# EAGLE schematic dw08b (EAGLE 6.6.0)

## Sheet 1 of 6
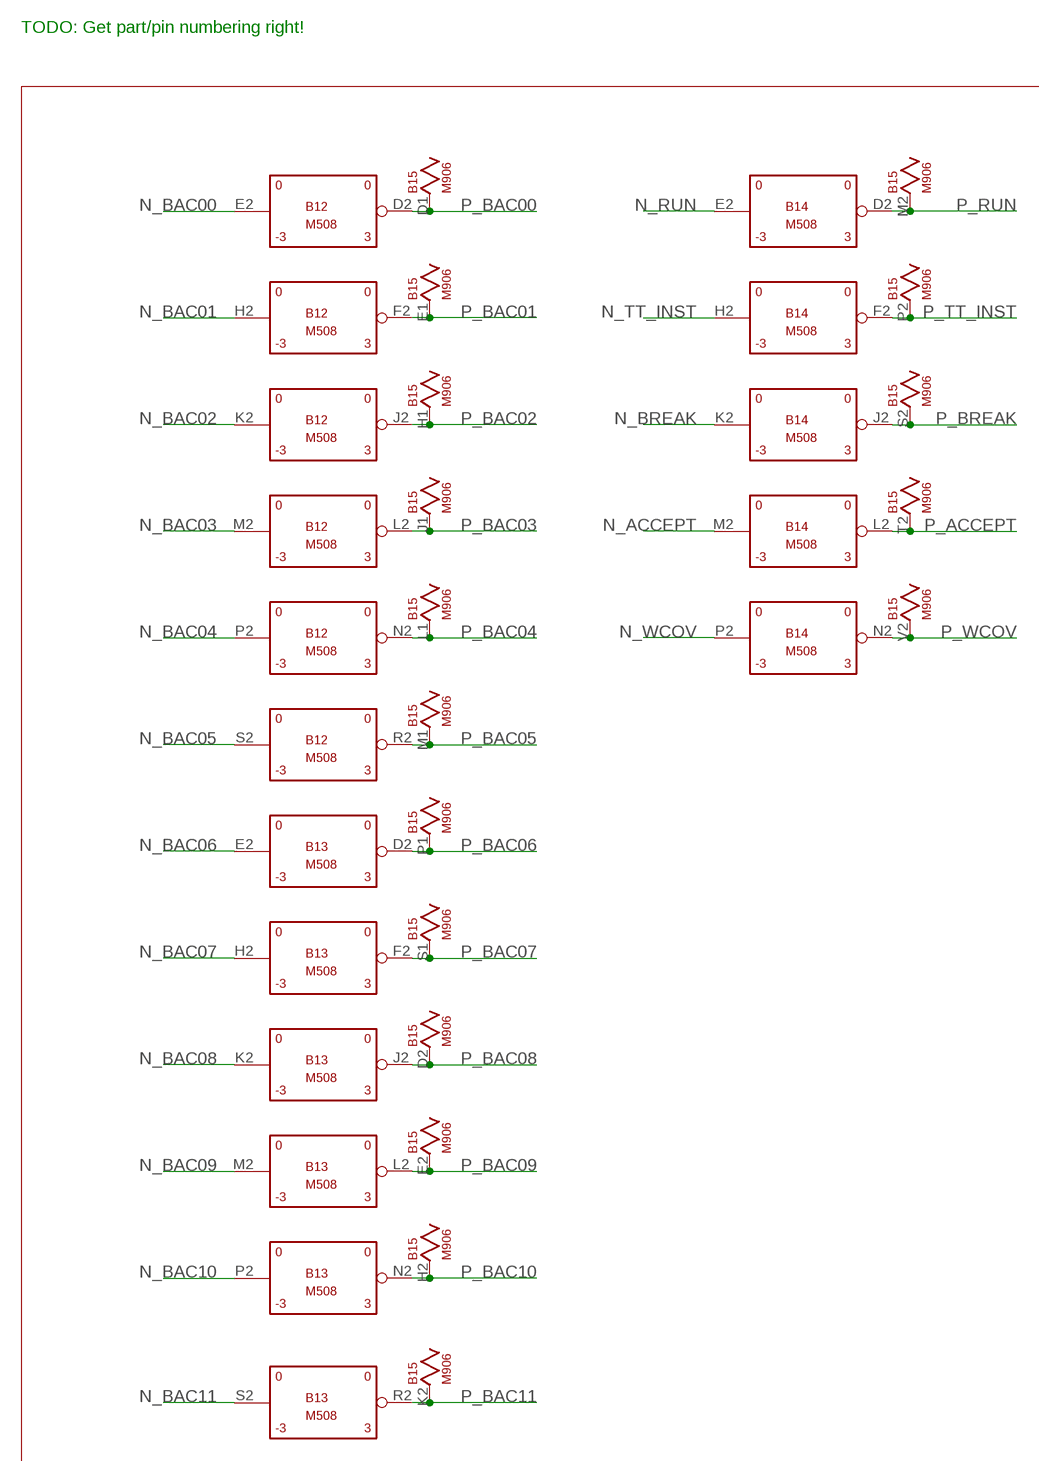
[diagram p0: schematic, sheet 1, part 1 of 2]
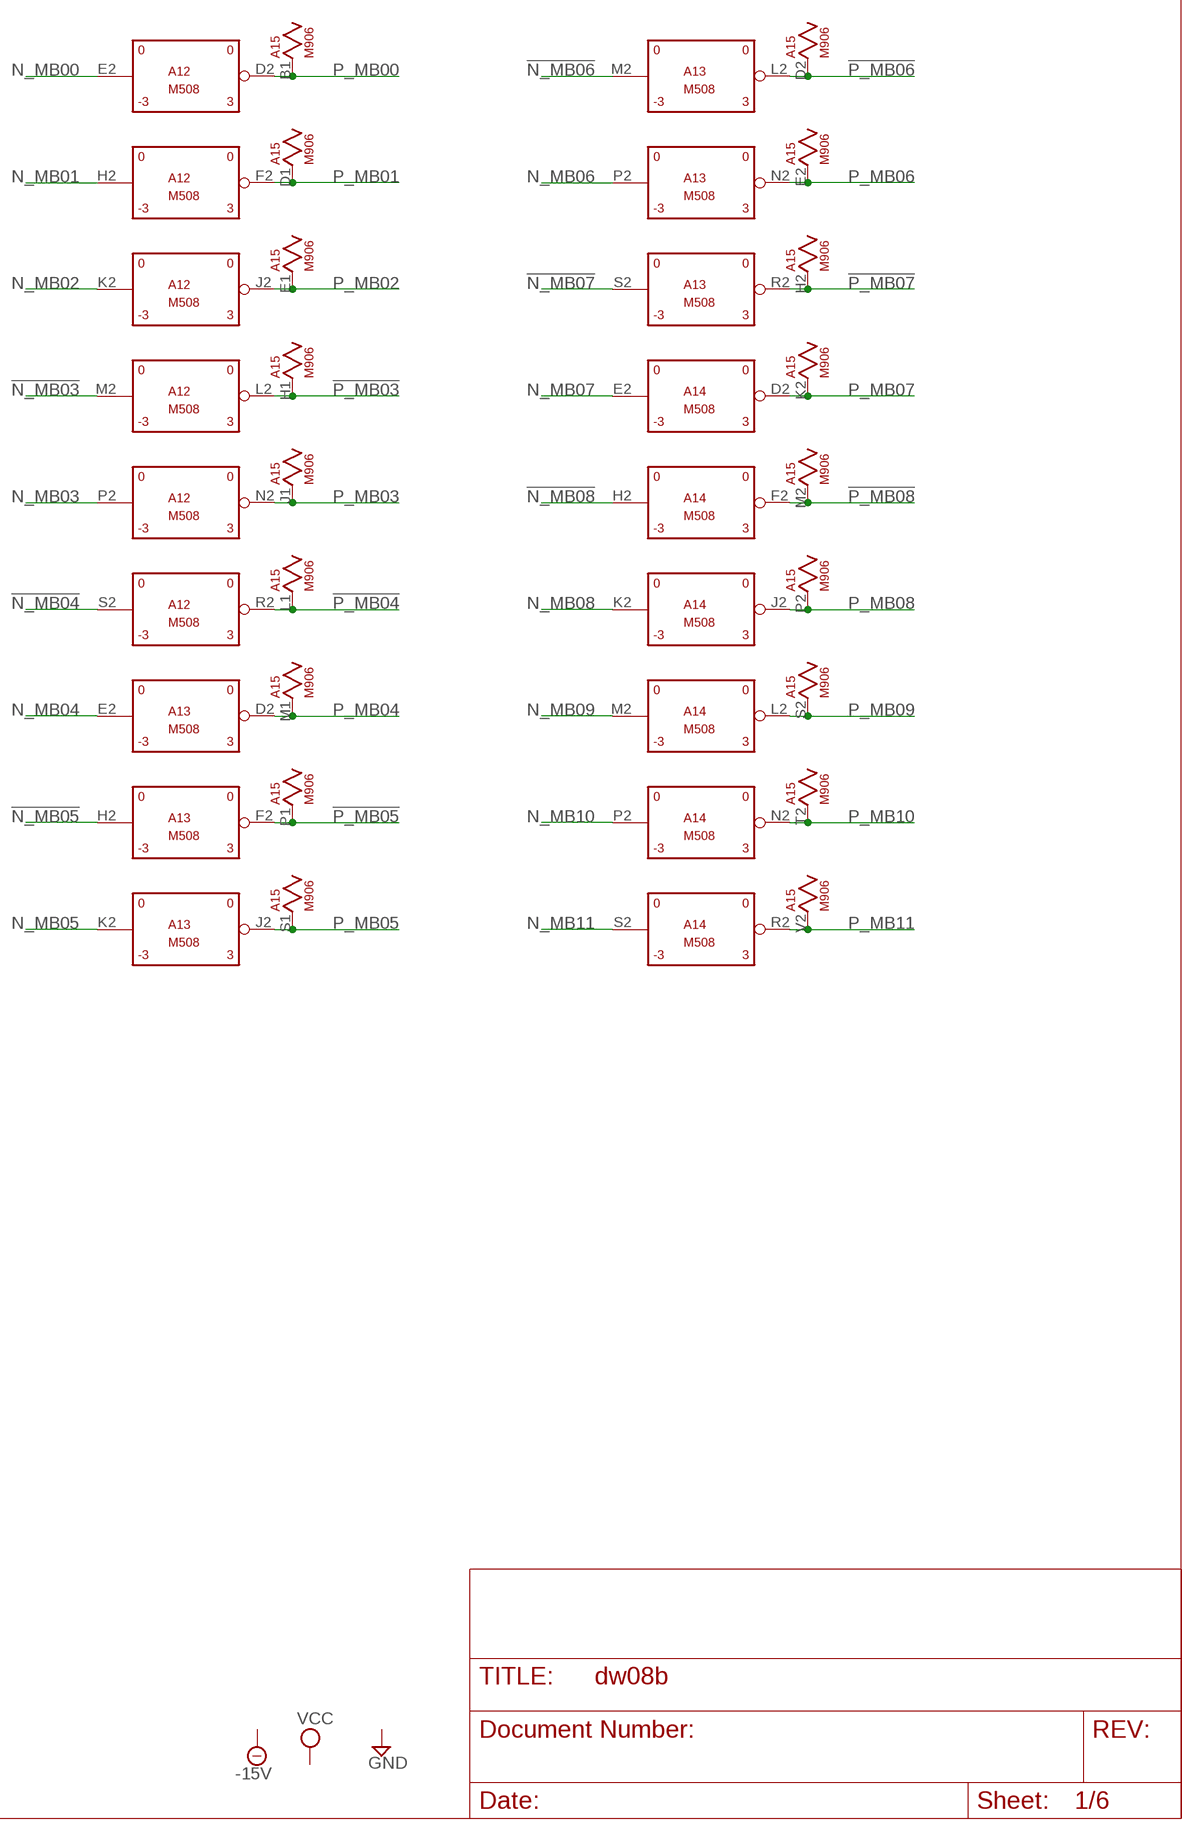
[diagram p1: schematic, sheet 1, part 2 of 2]

### Parts
A12  M508  [H807]
A13  M508  [H807]
A14  M508  [H807]
A15  M906  [H807]
B12  M508  [H807]
B13  M508  [H807]
B14  M508  [H807]
B15  M906  [H807]

### Nets
!N_MB03: A12.M2(L:IN) ; also sheet 5
!N_MB04: A12.S2(R:IN) ; also sheet 5
!N_MB05: A13.H2(F:IN) ; also sheet 5
!N_MB06: A13.M2(L:IN) ; also sheet 5
!N_MB07: A13.S2(R:IN) ; also sheet 5
!N_MB08: A14.H2(F:IN) ; also sheet 5
!P_MB03: A12.L2(L:OUT) A15.H1 ; also sheet 6
!P_MB04: A12.R2(R:OUT) A15.L1 ; also sheet 6
!P_MB05: A13.F2(F:OUT) A15.P1 ; also sheet 6
!P_MB06: A13.L2(L:OUT) A15.D2 ; also sheet 6
!P_MB07: A13.R2(R:OUT) A15.H2 ; also sheet 6
!P_MB08: A14.F2(F:OUT) A15.M2 ; also sheet 6
N_ACCEPT: B14.M2(L:IN) ; also sheet 5
N_BAC00: B12.E2(D:IN) ; also sheet 5
N_BAC01: B12.H2(F:IN) ; also sheet 5
N_BAC02: B12.K2(J:IN) ; also sheet 5
N_BAC03: B12.M2(L:IN) ; also sheet 5
N_BAC04: B12.P2(N:IN) ; also sheet 5
N_BAC05: B12.S2(R:IN) ; also sheet 5
N_BAC06: B13.E2(D:IN) ; also sheet 5
N_BAC07: B13.H2(F:IN) ; also sheet 5
N_BAC08: B13.K2(J:IN) ; also sheet 5
N_BAC09: B13.M2(L:IN) ; also sheet 5
N_BAC10: B13.P2(N:IN) ; also sheet 5
N_BAC11: B13.S2(R:IN) ; also sheet 5
N_BREAK: B14.K2(J:IN) ; also sheet 5
N_MB00: A12.E2(D:IN) ; also sheet 5
N_MB01: A12.H2(F:IN) ; also sheet 5
N_MB02: A12.K2(J:IN) ; also sheet 5
N_MB03: A12.P2(N:IN) ; also sheet 5
N_MB04: A13.E2(D:IN) ; also sheet 5
N_MB05: A13.K2(J:IN) ; also sheet 5
N_MB06: A13.P2(N:IN) ; also sheet 5
N_MB07: A14.E2(D:IN) ; also sheet 5
N_MB08: A14.K2(J:IN) ; also sheet 5
N_MB09: A14.M2(L:IN) ; also sheet 5
N_MB10: A14.P2(N:IN) ; also sheet 5
N_MB11: A14.S2(R:IN) ; also sheet 5
N_RUN: B14.E2(D:IN) ; also sheet 5
N_TT_INST: B14.H2(F:IN) ; also sheet 5
N_WCOV: B14.P2(N:IN) ; also sheet 5
P_ACCEPT: B14.L2(L:OUT) B15.T2 ; also sheet 6
P_BAC00: B12.D2(D:OUT) B15.D1 ; also sheet 6
P_BAC01: B12.F2(F:OUT) B15.E1 ; also sheet 6
P_BAC02: B12.J2(J:OUT) B15.H1 ; also sheet 6
P_BAC03: B12.L2(L:OUT) B15.J1 ; also sheet 6
P_BAC04: B12.N2(N:OUT) B15.L1 ; also sheet 6
P_BAC05: B12.R2(R:OUT) B15.M1 ; also sheet 6
P_BAC06: B13.D2(D:OUT) B15.P1 ; also sheet 6
P_BAC07: B13.F2(F:OUT) B15.S1 ; also sheet 6
P_BAC08: B13.J2(J:OUT) B15.D2 ; also sheet 6
P_BAC09: B13.L2(L:OUT) B15.E2 ; also sheet 6
P_BAC10: B13.N2(N:OUT) B15.H2 ; also sheet 6
P_BAC11: B13.R2(R:OUT) B15.K2 ; also sheet 6
P_BREAK: B14.J2(J:OUT) B15.S2 ; also sheet 6
P_MB00: A12.D2(D:OUT) A15.B1 ; also sheet 6
P_MB01: A12.F2(F:OUT) A15.D1 ; also sheet 6
P_MB02: A12.J2(J:OUT) A15.E1 ; also sheet 6
P_MB03: A12.N2(N:OUT) A15.J1 ; also sheet 6
P_MB04: A13.D2(D:OUT) A15.M1 ; also sheet 6
P_MB05: A13.J2(J:OUT) A15.S1 ; also sheet 6
P_MB06: A13.N2(N:OUT) A15.E2 ; also sheet 6
P_MB07: A14.D2(D:OUT) A15.K2 ; also sheet 6
P_MB08: A14.J2(J:OUT) A15.P2 ; also sheet 6
P_MB09: A14.L2(L:OUT) A15.S2 ; also sheet 6
P_MB10: A14.N2(N:OUT) A15.T2 ; also sheet 6
P_MB11: A14.R2(R:OUT) A15.V2 ; also sheet 6
P_RUN: B14.D2(D:OUT) B15.M2 ; also sheet 6
P_TT_INST: B14.F2(F:OUT) B15.P2 ; also sheet 6
P_WCOV: B14.N2(N:OUT) B15.V2 ; also sheet 6
Unconnected: B14.R2(R:OUT) B14.S2(R:IN)

### Notes on the sheet
- TODO: Get part/pin numbering right!

## Sheet 2 of 6
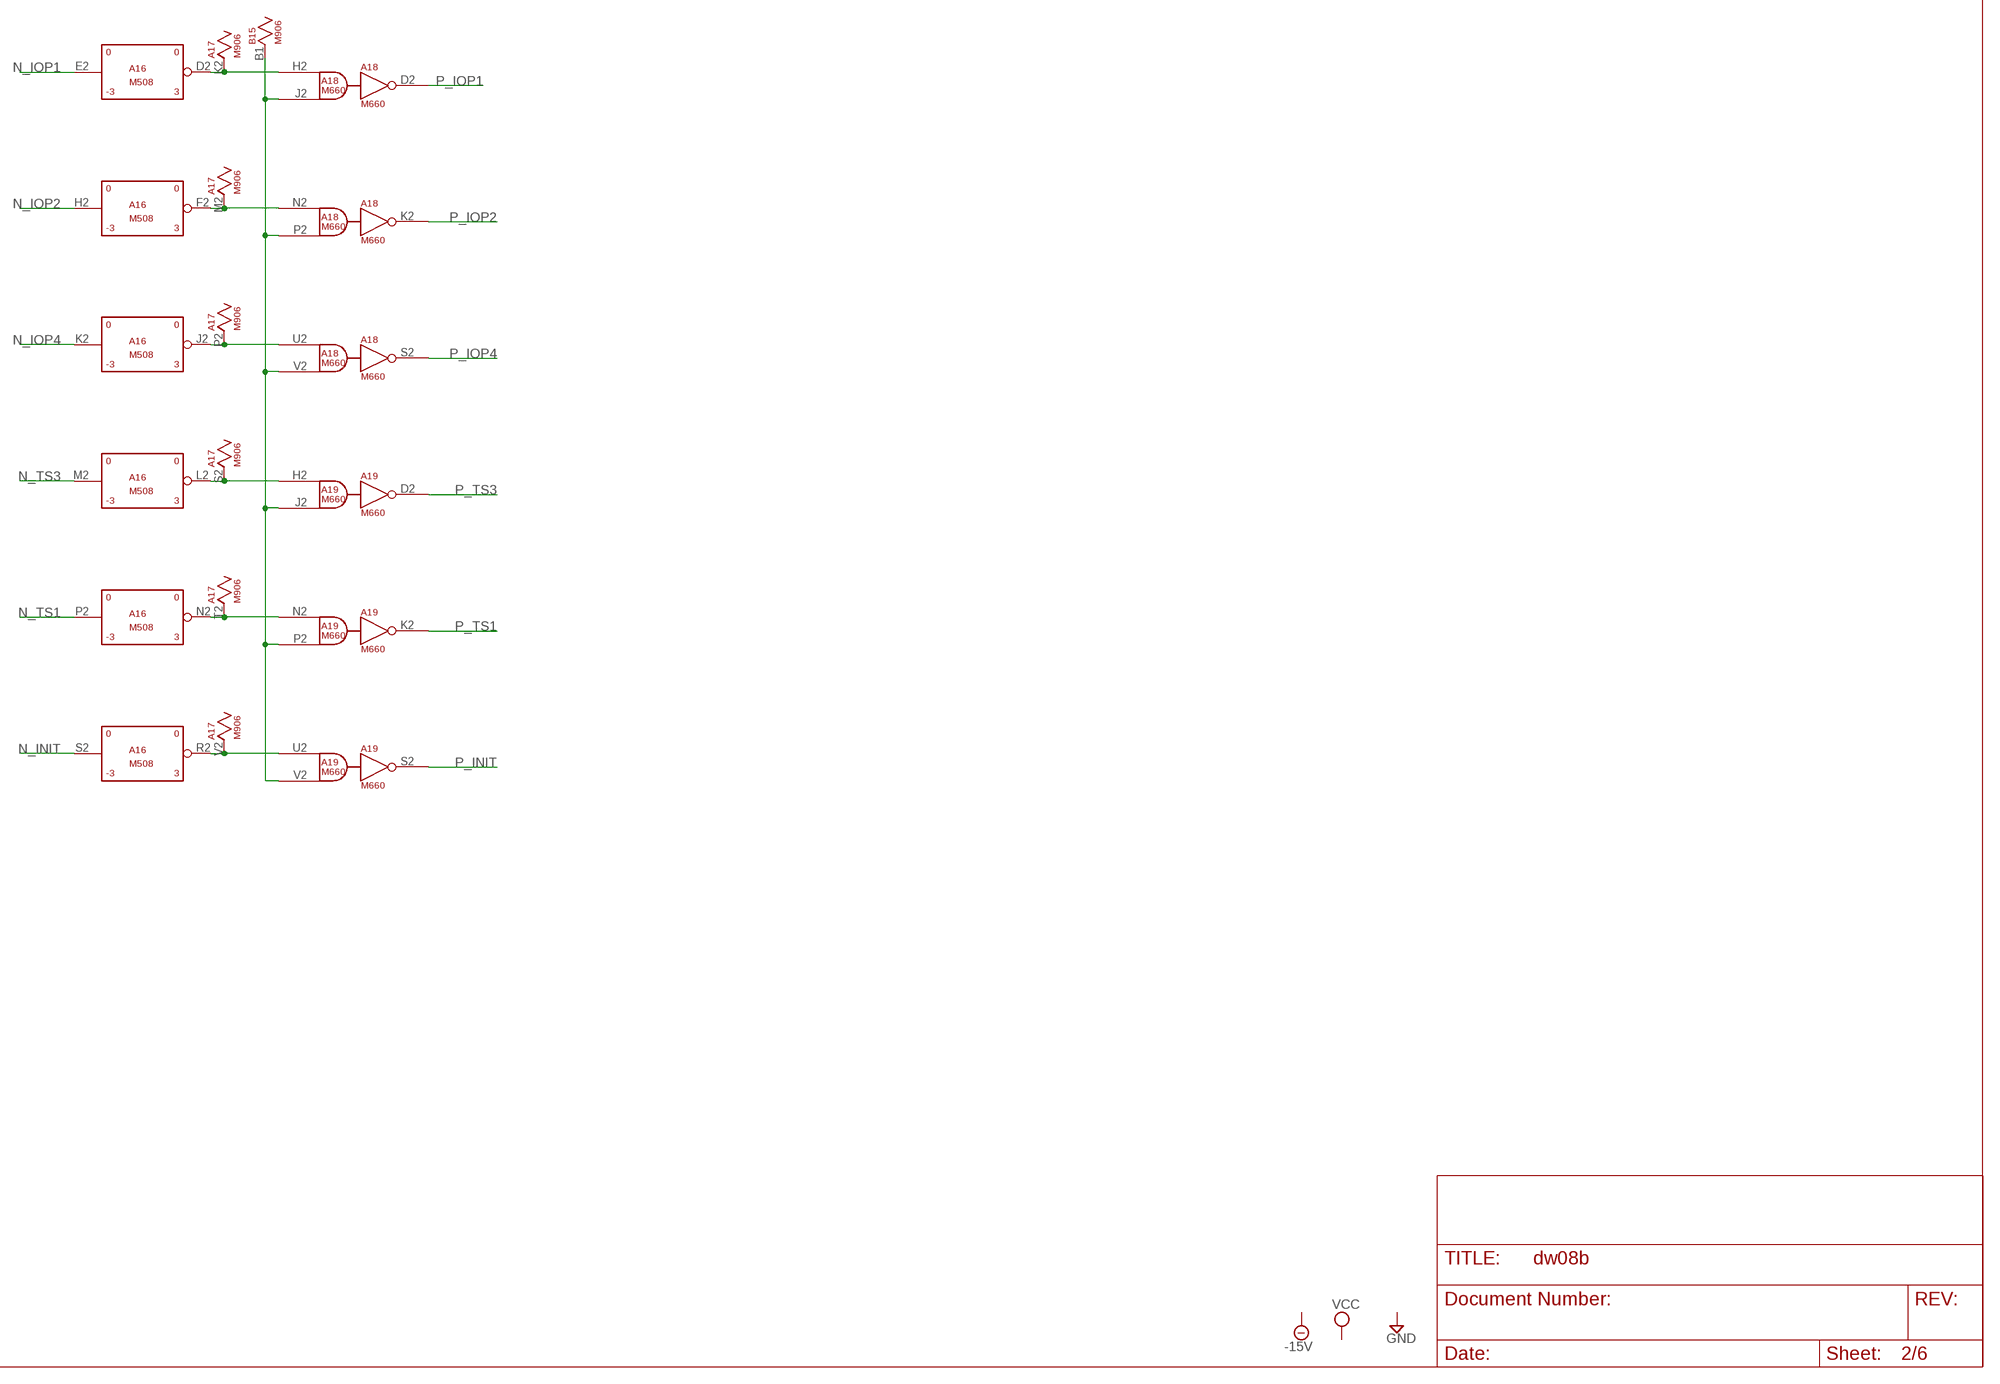
[diagram p2: schematic, sheet 2]

### Parts
A16  M508  [H807]
A17  M906  [H807]
A18  M660  [H807]
A19  M660  [H807]

### Nets
N$1: A16.D2(D:OUT) A17.K2 A18.H2(D:IN1)
N$2: A16.F2(F:OUT) A17.M2 A18.N2(K:IN1)
N$3: A16.J2(J:OUT) A17.P2 A18.U2(S:IN1)
N$4: A16.L2(L:OUT) A17.S2 A19.H2(D:IN1)
N$5: A16.N2(N:OUT) A17.T2 A19.N2(K:IN1)
N$6: A16.R2(R:OUT) A17.V2 A19.U2(S:IN1)
N$7: A18.J2(D:IN2) A18.P2(K:IN2) A18.V2(S:IN2) A19.J2(D:IN2) A19.P2(K:IN2) A19.V2(S:IN2) B15.B1
N_INIT: A16.S2(R:IN) ; also sheet 5
N_IOP1: A16.E2(D:IN) ; also sheet 5
N_IOP2: A16.H2(F:IN) ; also sheet 5
N_IOP4: A16.K2(J:IN) ; also sheet 5
N_TS1: A16.P2(N:IN) ; also sheet 5
N_TS3: A16.M2(L:IN) ; also sheet 5
P_INIT: A19.S2(S:OUT) ; also sheet 6
P_IOP1: A18.D2(D:OUT) ; also sheet 6
P_IOP2: A18.K2(K:OUT) ; also sheet 6
P_IOP4: A18.S2(S:OUT) ; also sheet 6
P_TS1: A19.K2(K:OUT) ; also sheet 6
P_TS3: A19.D2(D:OUT) ; also sheet 6

## Sheet 3 of 6
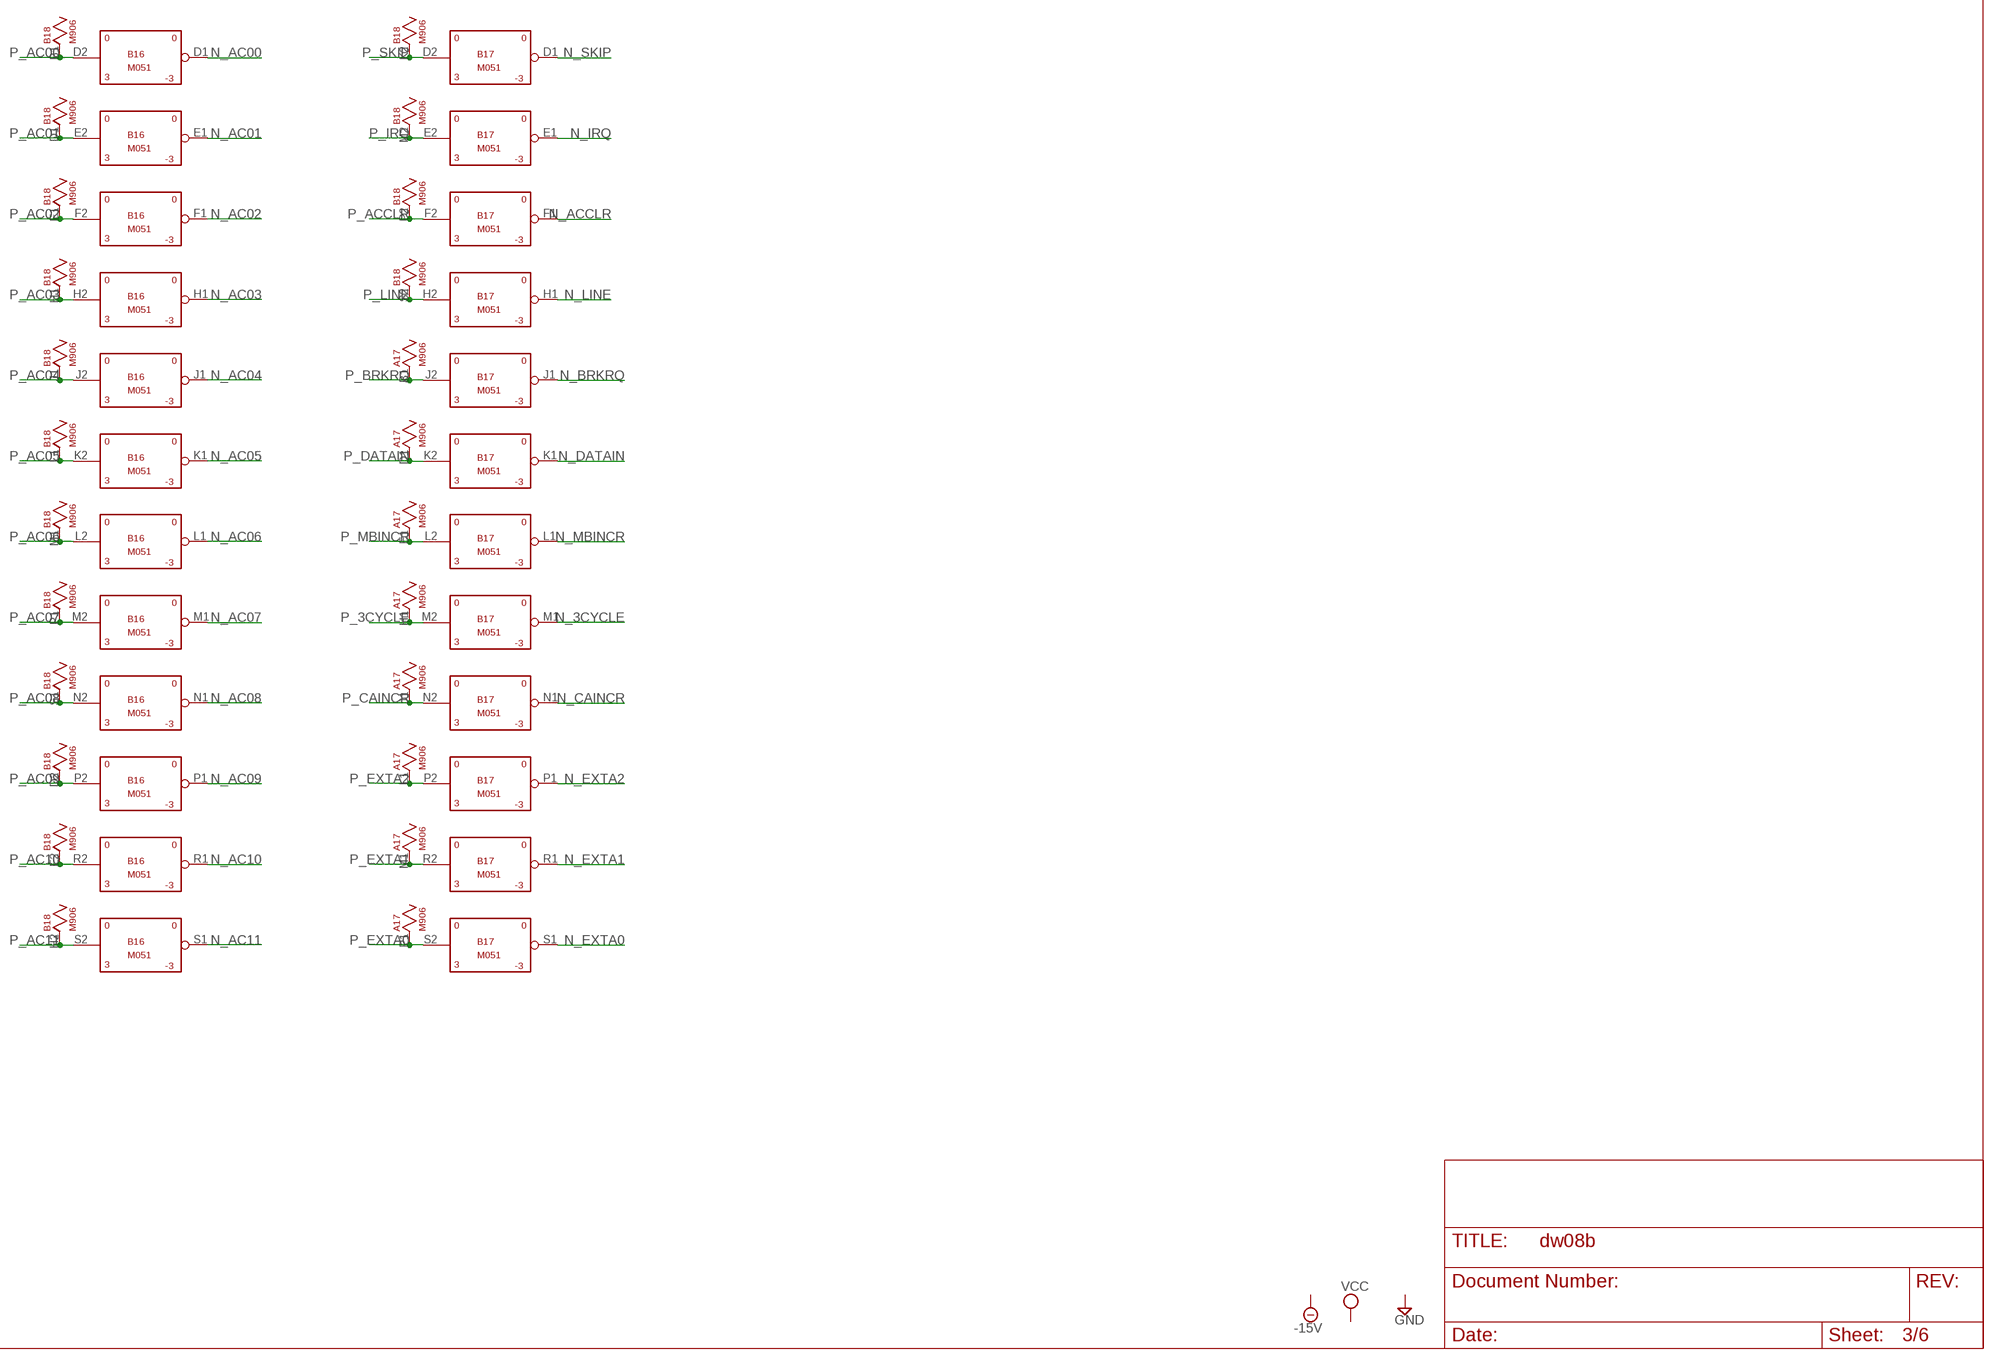
[diagram p3: schematic, sheet 3]

### Parts
B16  M051  [H807]
B17  M051  [H807]
B18  M906  [H807]

### Nets
N_3CYCLE: B17.M1(M1:OUT) ; also sheet 5
N_AC00: B16.D1(D1:OUT) ; also sheet 5
N_AC01: B16.E1(E`:OUT) ; also sheet 5
N_AC02: B16.F1(F1:OUT) ; also sheet 5
N_AC03: B16.H1(H1:OUT) ; also sheet 5
N_AC04: B16.J1(J1:OUT) ; also sheet 5
N_AC05: B16.K1(K1:OUT) ; also sheet 5
N_AC06: B16.L1(L1:OUT) ; also sheet 5
N_AC07: B16.M1(M1:OUT) ; also sheet 5
N_AC08: B16.N1(N1:OUT) ; also sheet 5
N_AC09: B16.P1(P1:OUT) ; also sheet 5
N_AC10: B16.R1(R1:OUT) ; also sheet 5
N_AC11: B16.S1(S1:OUT) ; also sheet 5
N_ACCLR: B17.F1(F1:OUT) ; also sheet 5
N_BRKRQ: B17.J1(J1:OUT) ; also sheet 5
N_CAINCR: B17.N1(N1:OUT) ; also sheet 5
N_DATAIN: B17.K1(K1:OUT) ; also sheet 5
N_EXTA0: B17.S1(S1:OUT) ; also sheet 5
N_EXTA1: B17.R1(R1:OUT) ; also sheet 5
N_EXTA2: B17.P1(P1:OUT) ; also sheet 5
N_IRQ: B17.E1(E`:OUT) ; also sheet 5
N_LINE: B17.H1(H1:OUT) ; also sheet 5
N_MBINCR: B17.L1(L1:OUT) ; also sheet 5
N_SKIP: B17.D1(D1:OUT) ; also sheet 5
P_3CYCLE: A17.H1 B17.M2(M1:IN) ; also sheet 6
P_AC00: B16.D2(D1:IN) B18.B1 ; also sheet 6
P_AC01: B16.E2(E`:IN) B18.D1 ; also sheet 6
P_AC02: B16.F2(F1:IN) B18.E1 ; also sheet 6
P_AC03: B16.H2(H1:IN) B18.H1 ; also sheet 6
P_AC04: B16.J2(J1:IN) B18.J1 ; also sheet 6
P_AC05: B16.K2(K1:IN) B18.L1 ; also sheet 6
P_AC06: B16.L2(L1:IN) B18.M1 ; also sheet 6
P_AC07: B16.M2(M1:IN) B18.P1 ; also sheet 6
P_AC08: B16.N2(N1:IN) B18.S1 ; also sheet 6
P_AC09: B16.P2(P1:IN) B18.D2 ; also sheet 6
P_AC10: B16.R2(R1:IN) B18.E2 ; also sheet 6
P_AC11: B16.S2(S1:IN) B18.H2 ; also sheet 6
P_ACCLR: B17.F2(F1:IN) B18.P2 ; also sheet 6
P_BRKRQ: A17.B1 B17.J2(J1:IN) ; also sheet 6
P_CAINCR: A17.J1 B17.N2(N1:IN) ; also sheet 6
P_DATAIN: A17.D1 B17.K2(K1:IN) ; also sheet 6
P_EXTA0: A17.P1 B17.S2(S1:IN) ; also sheet 6
P_EXTA1: A17.M1 B17.R2(R1:IN) ; also sheet 6
P_EXTA2: A17.L1 B17.P2(P1:IN) ; also sheet 6
P_IRQ: B17.E2(E`:IN) B18.M2 ; also sheet 6
P_LINE: B17.H2(H1:IN) B18.S2 ; also sheet 6
P_MBINCR: A17.E1 B17.L2(L1:IN) ; also sheet 6
P_SKIP: B17.D2(D1:IN) B18.K2 ; also sheet 6

## Sheet 4 of 6
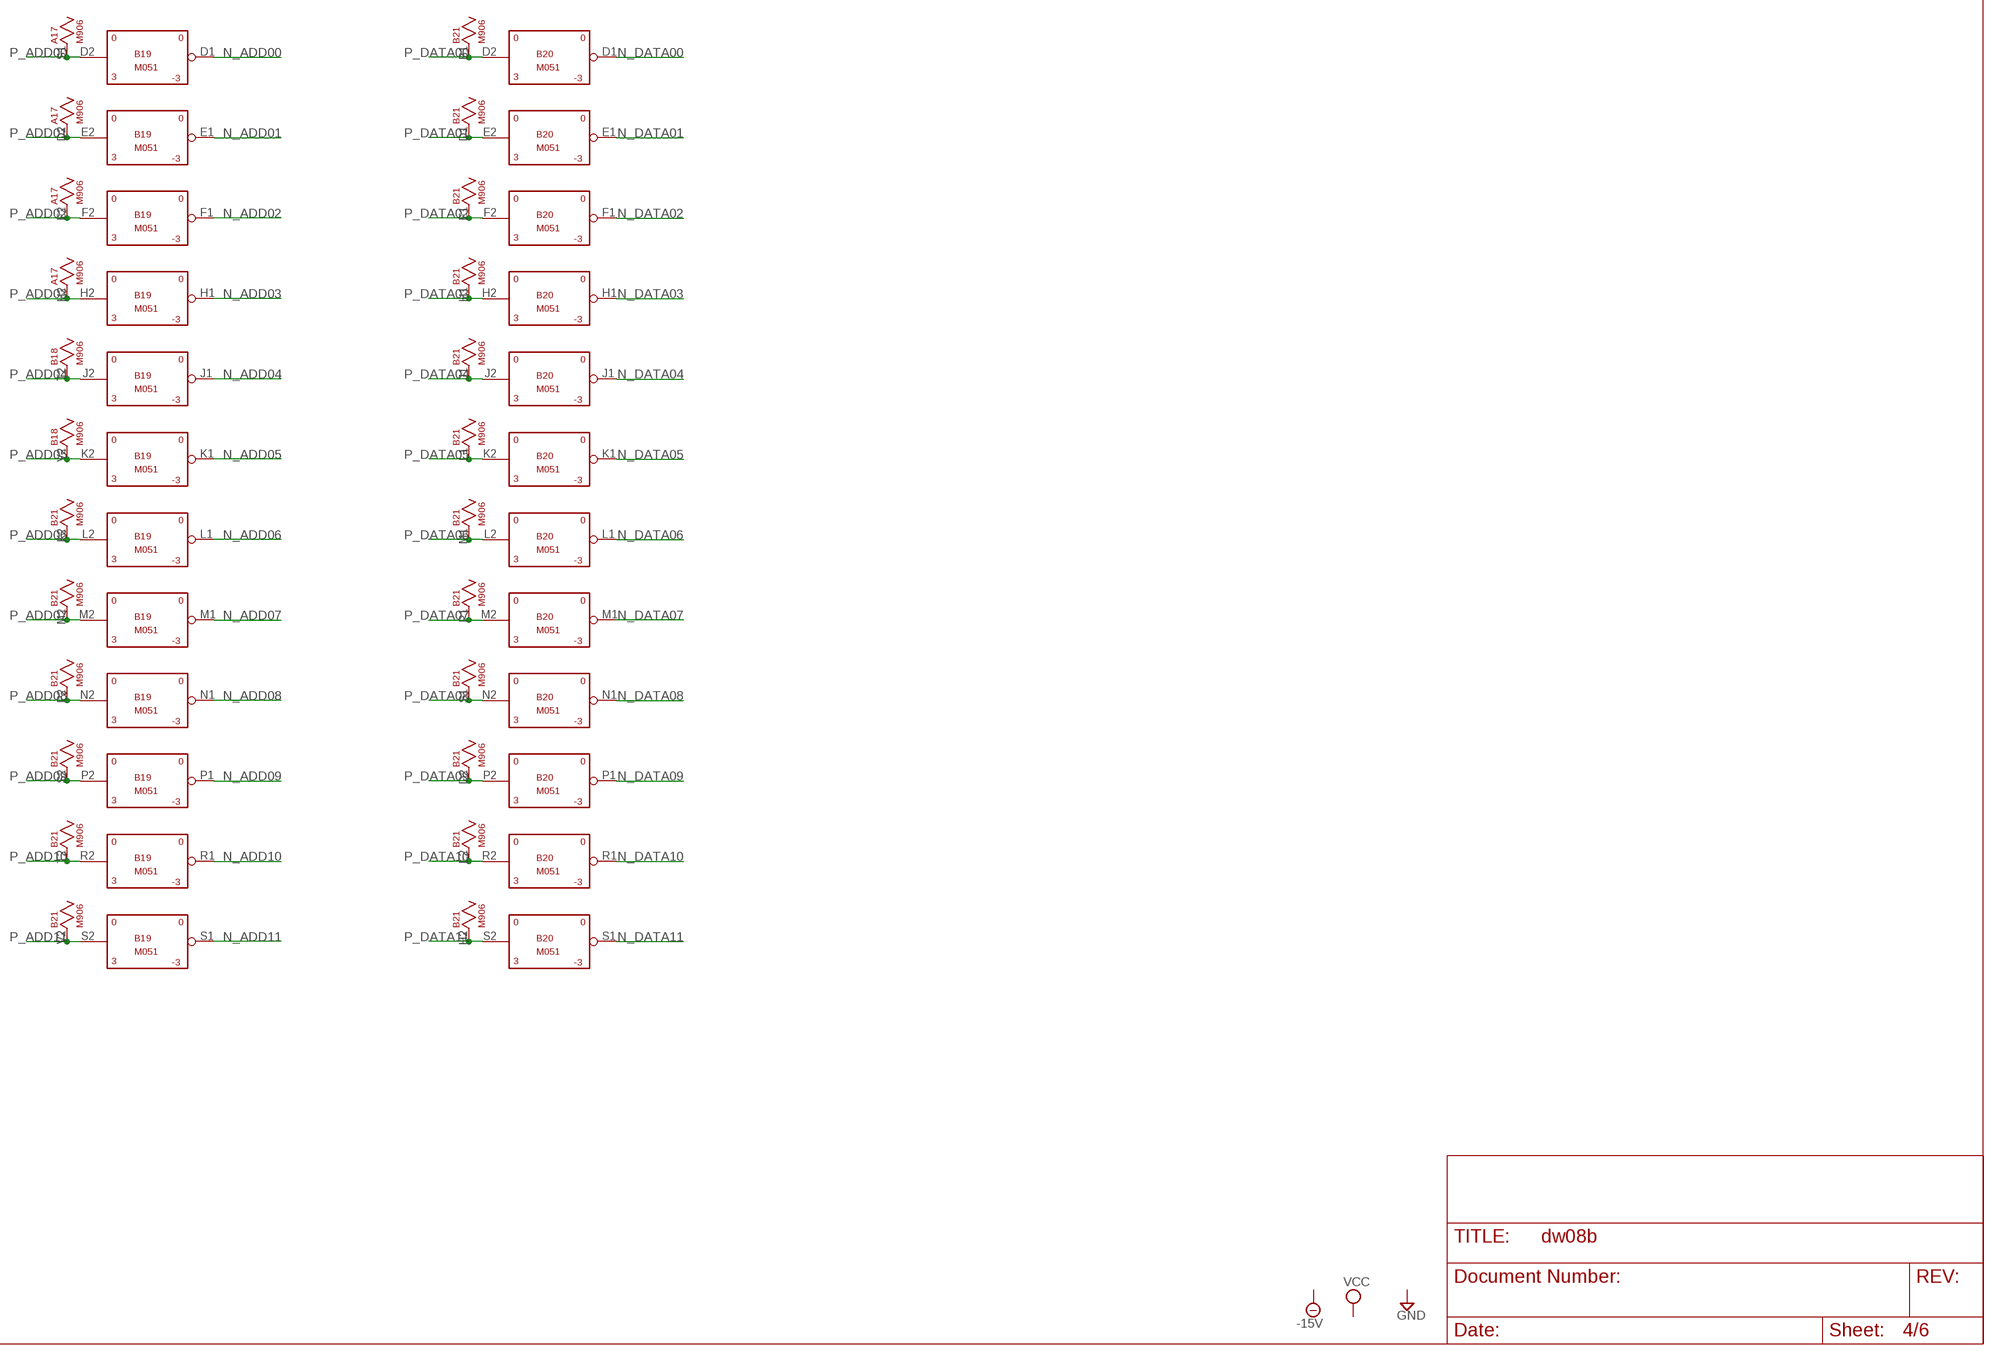
[diagram p4: schematic, sheet 4]

### Parts
B19  M051  [H807]
B20  M051  [H807]
B21  M906  [H807]

### Nets
N_ADD00: B19.D1(D1:OUT) ; also sheet 5
N_ADD01: B19.E1(E`:OUT) ; also sheet 5
N_ADD02: B19.F1(F1:OUT) ; also sheet 5
N_ADD03: B19.H1(H1:OUT) ; also sheet 5
N_ADD04: B19.J1(J1:OUT) ; also sheet 5
N_ADD05: B19.K1(K1:OUT) ; also sheet 5
N_ADD06: B19.L1(L1:OUT) ; also sheet 5
N_ADD07: B19.M1(M1:OUT) ; also sheet 5
N_ADD08: B19.N1(N1:OUT) ; also sheet 5
N_ADD09: B19.P1(P1:OUT) ; also sheet 5
N_ADD10: B19.R1(R1:OUT) ; also sheet 5
N_ADD11: B19.S1(S1:OUT) ; also sheet 5
N_DATA00: B20.D1(D1:OUT) ; also sheet 5
N_DATA01: B20.E1(E`:OUT) ; also sheet 5
N_DATA02: B20.F1(F1:OUT) ; also sheet 5
N_DATA03: B20.H1(H1:OUT) ; also sheet 5
N_DATA04: B20.J1(J1:OUT) ; also sheet 5
N_DATA05: B20.K1(K1:OUT) ; also sheet 5
N_DATA06: B20.L1(L1:OUT) ; also sheet 5
N_DATA07: B20.M1(M1:OUT) ; also sheet 5
N_DATA08: B20.N1(N1:OUT) ; also sheet 5
N_DATA09: B20.P1(P1:OUT) ; also sheet 5
N_DATA10: B20.R1(R1:OUT) ; also sheet 5
N_DATA11: B20.S1(S1:OUT) ; also sheet 5
P_ADD00: A17.S1 B19.D2(D1:IN) ; also sheet 6
P_ADD01: A17.D2 B19.E2(E`:IN) ; also sheet 6
P_ADD02: A17.E2 B19.F2(F1:IN) ; also sheet 6
P_ADD03: A17.H2 B19.H2(H1:IN) ; also sheet 6
P_ADD04: B18.T2 B19.J2(J1:IN) ; also sheet 6
P_ADD05: B18.V2 B19.K2(K1:IN) ; also sheet 6
P_ADD06: B19.L2(L1:IN) B21.K2 ; also sheet 6
P_ADD07: B19.M2(M1:IN) B21.M2 ; also sheet 6
P_ADD08: B19.N2(N1:IN) B21.P2 ; also sheet 6
P_ADD09: B19.P2(P1:IN) B21.S2 ; also sheet 6
P_ADD10: B19.R2(R1:IN) B21.T2 ; also sheet 6
P_ADD11: B19.S2(S1:IN) B21.V2 ; also sheet 6
P_DATA00: B20.D2(D1:IN) B21.B1 ; also sheet 6
P_DATA01: B20.E2(E`:IN) B21.D1 ; also sheet 6
P_DATA02: B20.F2(F1:IN) B21.E1 ; also sheet 6
P_DATA03: B20.H2(H1:IN) B21.H1 ; also sheet 6
P_DATA04: B20.J2(J1:IN) B21.J1 ; also sheet 6
P_DATA05: B20.K2(K1:IN) B21.L1 ; also sheet 6
P_DATA06: B20.L2(L1:IN) B21.M1 ; also sheet 6
P_DATA07: B20.M2(M1:IN) B21.P1 ; also sheet 6
P_DATA08: B20.N2(N1:IN) B21.S1 ; also sheet 6
P_DATA09: B20.P2(P1:IN) B21.D2 ; also sheet 6
P_DATA10: B20.R2(R1:IN) B21.E2 ; also sheet 6
P_DATA11: B20.S2(S1:IN) B21.H2 ; also sheet 6

## Sheet 5 of 6
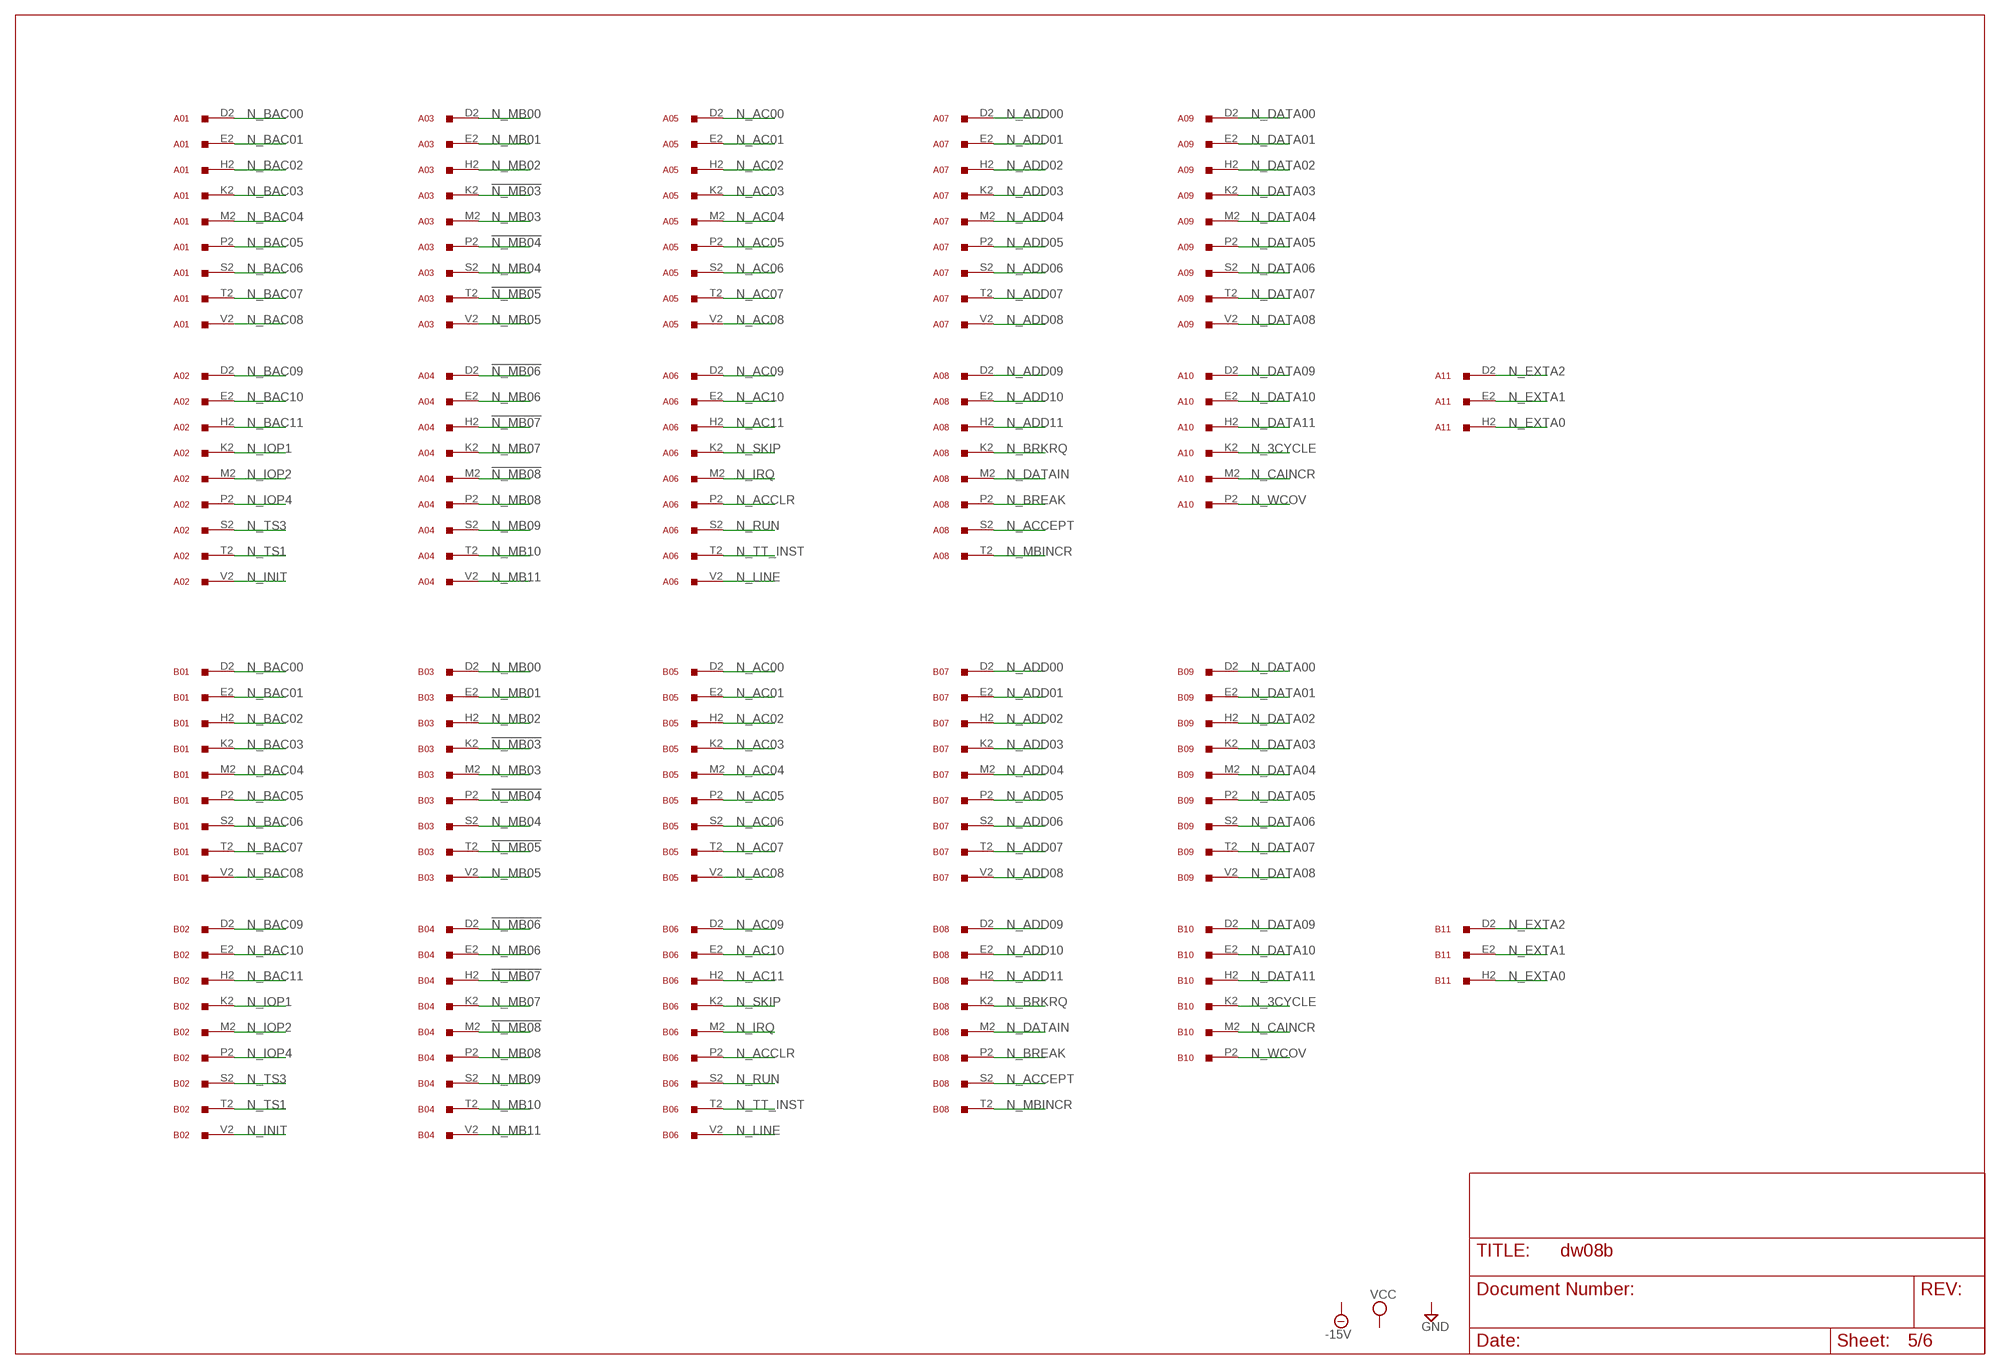
[diagram p5: schematic, sheet 5]

### Parts
A01  W011  [H807]
A02  W011  [H807]
A03  W011  [H807]
A04  W011  [H807]
A05  W011  [H807]
A06  W011  [H807]
A07  W011  [H807]
A08  W011  [H807]
A09  W011  [H807]
A10  W011  [H807]
A11  W011  [H807]
B01  W011  [H807]
B02  W011  [H807]
B03  W011  [H807]
B04  W011  [H807]
B05  W011  [H807]
B06  W011  [H807]
B07  W011  [H807]
B08  W011  [H807]
B09  W011  [H807]
B10  W011  [H807]
B11  W011  [H807]

### Nets
!N_MB03: A03.K2 B03.K2 ; also sheet 1
!N_MB04: A03.P2 B03.P2 ; also sheet 1
!N_MB05: A03.T2 B03.T2 ; also sheet 1
!N_MB06: A04.D2 B04.D2 ; also sheet 1
!N_MB07: A04.H2 B04.H2 ; also sheet 1
!N_MB08: A04.M2 B04.M2 ; also sheet 1
N_3CYCLE: A10.K2 B10.K2 ; also sheet 3
N_AC00: A05.D2 B05.D2 ; also sheet 3
N_AC01: A05.E2 B05.E2 ; also sheet 3
N_AC02: A05.H2 B05.H2 ; also sheet 3
N_AC03: A05.K2 B05.K2 ; also sheet 3
N_AC04: A05.M2 B05.M2 ; also sheet 3
N_AC05: A05.P2 B05.P2 ; also sheet 3
N_AC06: A05.S2 B05.S2 ; also sheet 3
N_AC07: A05.T2 B05.T2 ; also sheet 3
N_AC08: A05.V2 B05.V2 ; also sheet 3
N_AC09: A06.D2 B06.D2 ; also sheet 3
N_AC10: A06.E2 B06.E2 ; also sheet 3
N_AC11: A06.H2 B06.H2 ; also sheet 3
N_ACCEPT: A08.S2 B08.S2 ; also sheet 1
N_ACCLR: A06.P2 B06.P2 ; also sheet 3
N_ADD00: A07.D2 B07.D2 ; also sheet 4
N_ADD01: A07.E2 B07.E2 ; also sheet 4
N_ADD02: A07.H2 B07.H2 ; also sheet 4
N_ADD03: A07.K2 B07.K2 ; also sheet 4
N_ADD04: A07.M2 B07.M2 ; also sheet 4
N_ADD05: A07.P2 B07.P2 ; also sheet 4
N_ADD06: A07.S2 B07.S2 ; also sheet 4
N_ADD07: A07.T2 B07.T2 ; also sheet 4
N_ADD08: A07.V2 B07.V2 ; also sheet 4
N_ADD09: A08.D2 B08.D2 ; also sheet 4
N_ADD10: A08.E2 B08.E2 ; also sheet 4
N_ADD11: A08.H2 B08.H2 ; also sheet 4
N_BAC00: A01.D2 B01.D2 ; also sheet 1
N_BAC01: A01.E2 B01.E2 ; also sheet 1
N_BAC02: A01.H2 B01.H2 ; also sheet 1
N_BAC03: A01.K2 B01.K2 ; also sheet 1
N_BAC04: A01.M2 B01.M2 ; also sheet 1
N_BAC05: A01.P2 B01.P2 ; also sheet 1
N_BAC06: A01.S2 B01.S2 ; also sheet 1
N_BAC07: A01.T2 B01.T2 ; also sheet 1
N_BAC08: A01.V2 B01.V2 ; also sheet 1
N_BAC09: A02.D2 B02.D2 ; also sheet 1
N_BAC10: A02.E2 B02.E2 ; also sheet 1
N_BAC11: A02.H2 B02.H2 ; also sheet 1
N_BREAK: A08.P2 B08.P2 ; also sheet 1
N_BRKRQ: A08.K2 B08.K2 ; also sheet 3
N_CAINCR: A10.M2 B10.M2 ; also sheet 3
N_DATA00: A09.D2 B09.D2 ; also sheet 4
N_DATA01: A09.E2 B09.E2 ; also sheet 4
N_DATA02: A09.H2 B09.H2 ; also sheet 4
N_DATA03: A09.K2 B09.K2 ; also sheet 4
N_DATA04: A09.M2 B09.M2 ; also sheet 4
N_DATA05: A09.P2 B09.P2 ; also sheet 4
N_DATA06: A09.S2 B09.S2 ; also sheet 4
N_DATA07: A09.T2 B09.T2 ; also sheet 4
N_DATA08: A09.V2 B09.V2 ; also sheet 4
N_DATA09: A10.D2 B10.D2 ; also sheet 4
N_DATA10: A10.E2 B10.E2 ; also sheet 4
N_DATA11: A10.H2 B10.H2 ; also sheet 4
N_DATAIN: A08.M2 B08.M2 ; also sheet 3
N_EXTA0: A11.H2 B11.H2 ; also sheet 3
N_EXTA1: A11.E2 B11.E2 ; also sheet 3
N_EXTA2: A11.D2 B11.D2 ; also sheet 3
N_INIT: A02.V2 B02.V2 ; also sheet 2
N_IOP1: A02.K2 B02.K2 ; also sheet 2
N_IOP2: A02.M2 B02.M2 ; also sheet 2
N_IOP4: A02.P2 B02.P2 ; also sheet 2
N_IRQ: A06.M2 B06.M2 ; also sheet 3
N_LINE: A06.V2 B06.V2 ; also sheet 3
N_MB00: A03.D2 B03.D2 ; also sheet 1
N_MB01: A03.E2 B03.E2 ; also sheet 1
N_MB02: A03.H2 B03.H2 ; also sheet 1
N_MB03: A03.M2 B03.M2 ; also sheet 1
N_MB04: A03.S2 B03.S2 ; also sheet 1
N_MB05: A03.V2 B03.V2 ; also sheet 1
N_MB06: A04.E2 B04.E2 ; also sheet 1
N_MB07: A04.K2 B04.K2 ; also sheet 1
N_MB08: A04.P2 B04.P2 ; also sheet 1
N_MB09: A04.S2 B04.S2 ; also sheet 1
N_MB10: A04.T2 B04.T2 ; also sheet 1
N_MB11: A04.V2 B04.V2 ; also sheet 1
N_MBINCR: A08.T2 B08.T2 ; also sheet 3
N_RUN: A06.S2 B06.S2 ; also sheet 1
N_SKIP: A06.K2 B06.K2 ; also sheet 3
N_TS1: A02.T2 B02.T2 ; also sheet 2
N_TS3: A02.S2 B02.S2 ; also sheet 2
N_TT_INST: A06.T2 B06.T2 ; also sheet 1
N_WCOV: A10.P2 B10.P2 ; also sheet 1
Unconnected: A08.V2 A10.S2 A10.T2 A10.V2 A11.K2 A11.M2 A11.P2 A11.S2 A11.T2 A11.V2 B08.V2 B10.S2 B10.T2 B10.V2 B11.K2 B11.M2 B11.P2 B11.S2 B11.T2 B11.V2

## Sheet 6 of 6
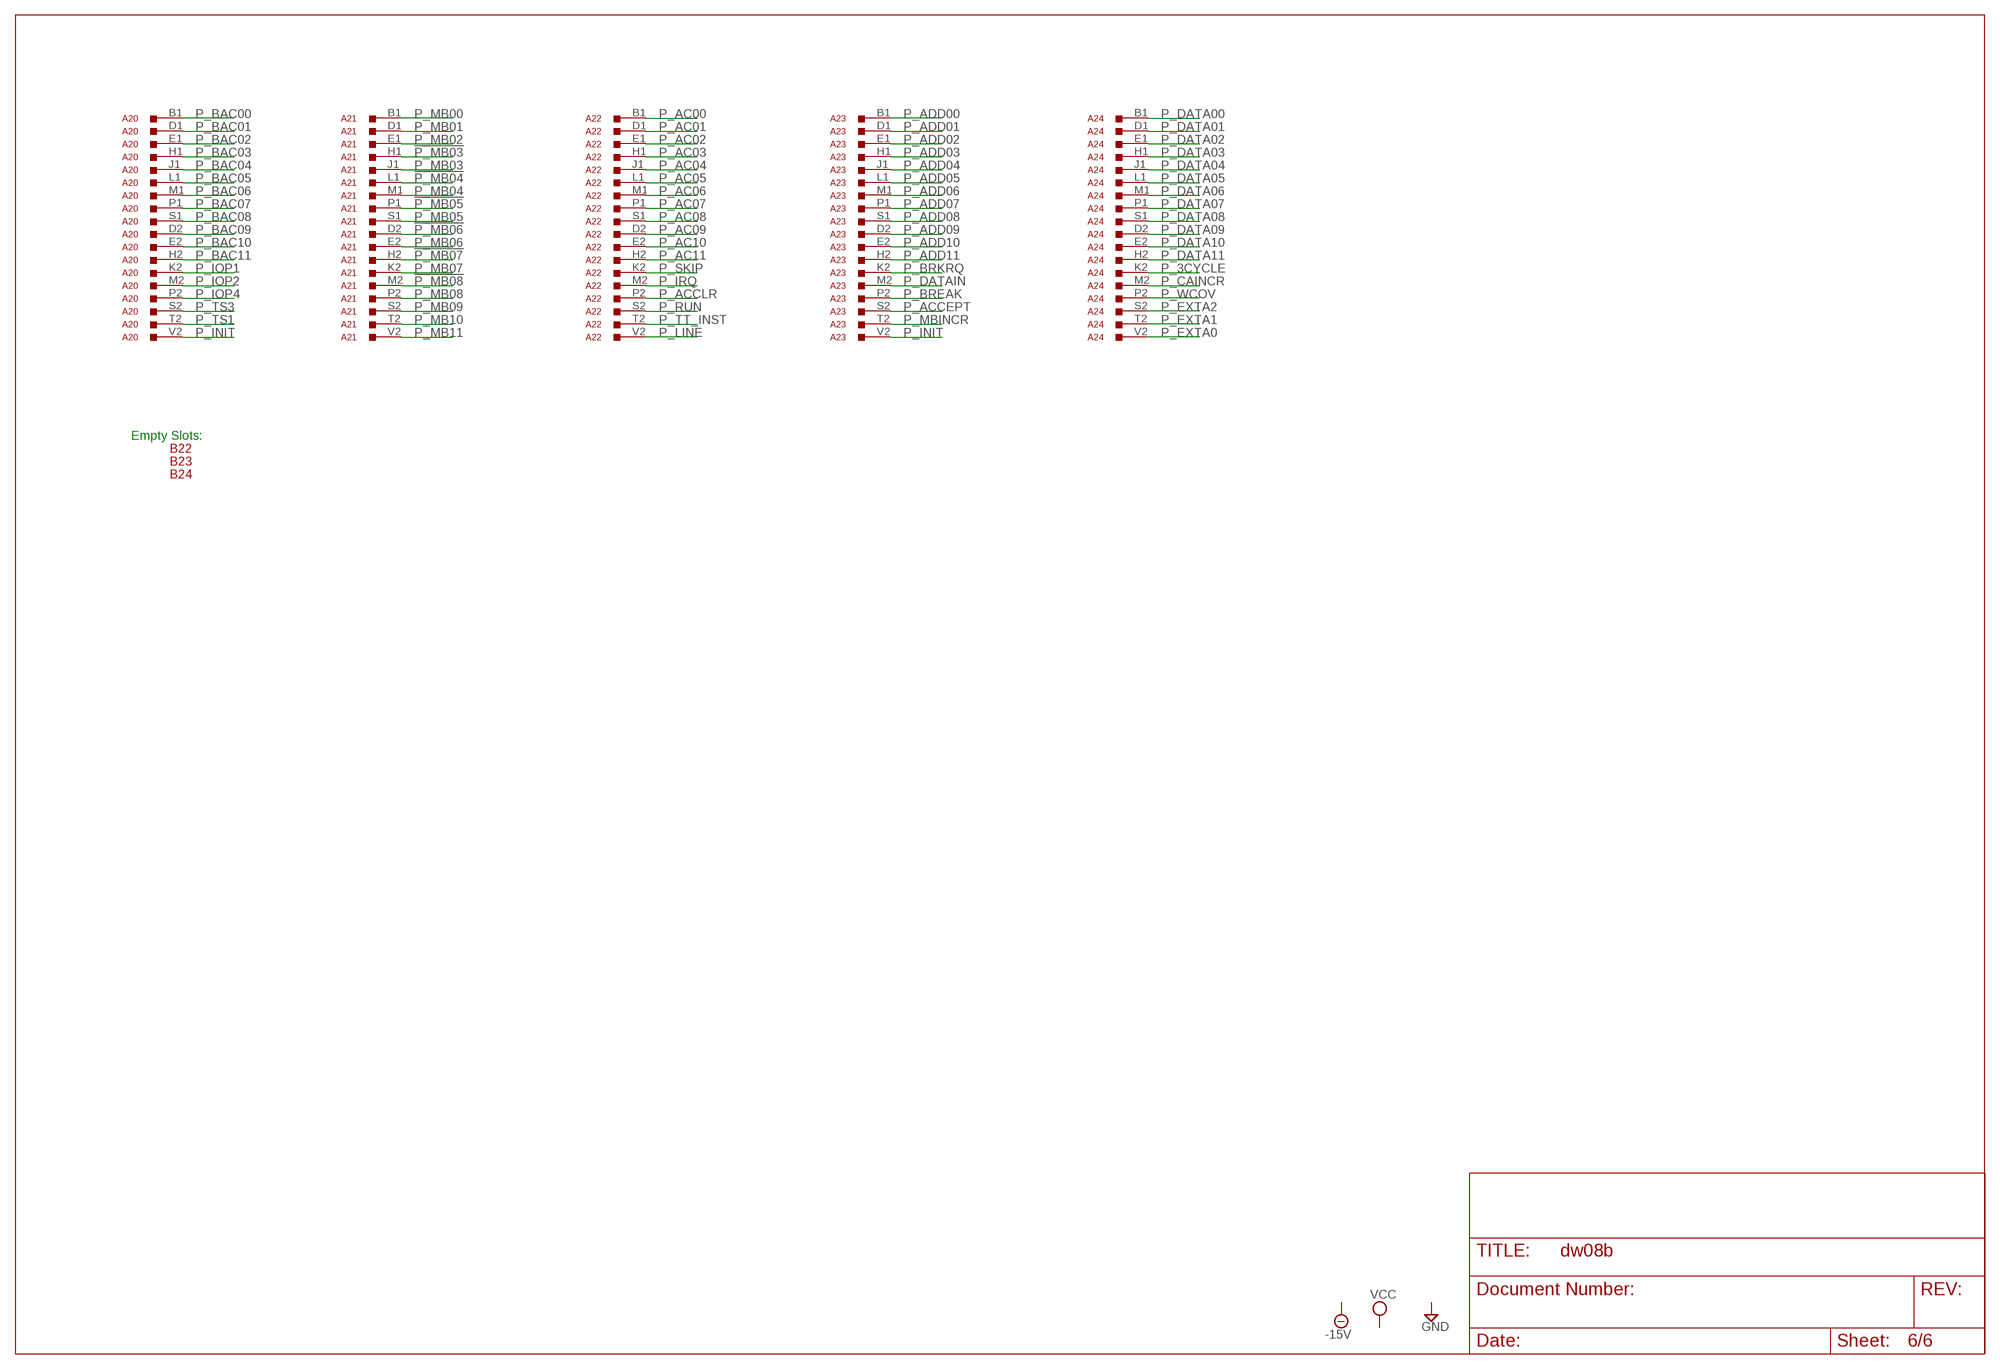
[diagram p6: schematic, sheet 6]

### Parts
A20  M903  [H807]
A21  M903  [H807]
A22  M903  [H807]
A23  M903  [H807]
A24  M903  [H807]
B22  H807  [H807]
B23  H807  [H807]
B24  H807  [H807]

### Nets
!P_MB03: A21.H1 ; also sheet 1
!P_MB04: A21.L1 ; also sheet 1
!P_MB05: A21.P1 ; also sheet 1
!P_MB06: A21.D2 ; also sheet 1
!P_MB07: A21.H2 ; also sheet 1
!P_MB08: A21.M2 ; also sheet 1
P_3CYCLE: A24.K2 ; also sheet 3
P_AC00: A22.B1 ; also sheet 3
P_AC01: A22.D1 ; also sheet 3
P_AC02: A22.E1 ; also sheet 3
P_AC03: A22.H1 ; also sheet 3
P_AC04: A22.J1 ; also sheet 3
P_AC05: A22.L1 ; also sheet 3
P_AC06: A22.M1 ; also sheet 3
P_AC07: A22.P1 ; also sheet 3
P_AC08: A22.S1 ; also sheet 3
P_AC09: A22.D2 ; also sheet 3
P_AC10: A22.E2 ; also sheet 3
P_AC11: A22.H2 ; also sheet 3
P_ACCEPT: A23.S2 ; also sheet 1
P_ACCLR: A22.P2 ; also sheet 3
P_ADD00: A23.B1 ; also sheet 4
P_ADD01: A23.D1 ; also sheet 4
P_ADD02: A23.E1 ; also sheet 4
P_ADD03: A23.H1 ; also sheet 4
P_ADD04: A23.J1 ; also sheet 4
P_ADD05: A23.L1 ; also sheet 4
P_ADD06: A23.M1 ; also sheet 4
P_ADD07: A23.P1 ; also sheet 4
P_ADD08: A23.S1 ; also sheet 4
P_ADD09: A23.D2 ; also sheet 4
P_ADD10: A23.E2 ; also sheet 4
P_ADD11: A23.H2 ; also sheet 4
P_BAC00: A20.B1 ; also sheet 1
P_BAC01: A20.D1 ; also sheet 1
P_BAC02: A20.E1 ; also sheet 1
P_BAC03: A20.H1 ; also sheet 1
P_BAC04: A20.J1 ; also sheet 1
P_BAC05: A20.L1 ; also sheet 1
P_BAC06: A20.M1 ; also sheet 1
P_BAC07: A20.P1 ; also sheet 1
P_BAC08: A20.S1 ; also sheet 1
P_BAC09: A20.D2 ; also sheet 1
P_BAC10: A20.E2 ; also sheet 1
P_BAC11: A20.H2 ; also sheet 1
P_BREAK: A23.P2 ; also sheet 1
P_BRKRQ: A23.K2 ; also sheet 3
P_CAINCR: A24.M2 ; also sheet 3
P_DATA00: A24.B1 ; also sheet 4
P_DATA01: A24.D1 ; also sheet 4
P_DATA02: A24.E1 ; also sheet 4
P_DATA03: A24.H1 ; also sheet 4
P_DATA04: A24.J1 ; also sheet 4
P_DATA05: A24.L1 ; also sheet 4
P_DATA06: A24.M1 ; also sheet 4
P_DATA07: A24.P1 ; also sheet 4
P_DATA08: A24.S1 ; also sheet 4
P_DATA09: A24.D2 ; also sheet 4
P_DATA10: A24.E2 ; also sheet 4
P_DATA11: A24.H2 ; also sheet 4
P_DATAIN: A23.M2 ; also sheet 3
P_EXTA0: A24.V2 ; also sheet 3
P_EXTA1: A24.T2 ; also sheet 3
P_EXTA2: A24.S2 ; also sheet 3
P_INIT: A20.V2 A23.V2 ; also sheet 2
P_IOP1: A20.K2 ; also sheet 2
P_IOP2: A20.M2 ; also sheet 2
P_IOP4: A20.P2 ; also sheet 2
P_IRQ: A22.M2 ; also sheet 3
P_LINE: A22.V2 ; also sheet 3
P_MB00: A21.B1 ; also sheet 1
P_MB01: A21.D1 ; also sheet 1
P_MB02: A21.E1 ; also sheet 1
P_MB03: A21.J1 ; also sheet 1
P_MB04: A21.M1 ; also sheet 1
P_MB05: A21.S1 ; also sheet 1
P_MB06: A21.E2 ; also sheet 1
P_MB07: A21.K2 ; also sheet 1
P_MB08: A21.P2 ; also sheet 1
P_MB09: A21.S2 ; also sheet 1
P_MB10: A21.T2 ; also sheet 1
P_MB11: A21.V2 ; also sheet 1
P_MBINCR: A23.T2 ; also sheet 3
P_RUN: A22.S2 ; also sheet 1
P_SKIP: A22.K2 ; also sheet 3
P_TS1: A20.T2 ; also sheet 2
P_TS3: A20.S2 ; also sheet 2
P_TT_INST: A22.T2 ; also sheet 1
P_WCOV: A24.P2 ; also sheet 1

### Notes on the sheet
- Empty Slots:

## Power pins joined to a net without a drawn wire
-15V: A12.B2(-15V) A13.B2(-15V) A14.B2(-15V) A16.B2(-15V) B12.B2(-15V) B13.B2(-15V) B14.B2(-15V) B16.B2(-15V) B17.B2(-15V) B19.B2(-15V) B20.B2(-15V)
GND: A01.C2 A01.F2 A01.J2 A01.L2 A01.N2 A01.R2 A01.U2 A02.C2 A02.F2 A02.J2 A02.L2 A02.N2 A02.R2 A02.U2 A03.C2 A03.F2 A03.J2 A03.L2 A03.N2 A03.R2 A03.U2 A04.C2 A04.F2 A04.J2 A04.L2 A04.N2 A04.R2 A04.U2 A05.C2 A05.F2 A05.J2 A05.L2 A05.N2 A05.R2 A05.U2 A06.C2 A06.F2 A06.J2 A06.L2 A06.N2 A06.R2 A06.U2 A07.C2 A07.F2 A07.J2 A07.L2 A07.N2 A07.R2 A07.U2 A08.C2 A08.F2 A08.J2 A08.L2 A08.N2 A08.R2 A08.U2 A09.C2 A09.F2 A09.J2 A09.L2 A09.N2 A09.R2 A09.U2 A10.C2 A10.F2 A10.J2 A10.L2 A10.N2 A10.R2 A10.U2 A11.C2 A11.F2 A11.J2 A11.L2 A11.N2 A11.R2 A11.U2 A12.C2(GND) A13.C2(GND) A14.C2(GND) A15.A1(A1:GND) A15.C1(C1:GND) A15.C2(GND) A15.F1(F1:GND) A15.F2(F2:GND) A15.J2(J2:GND) A15.K1(K1:GND) A15.L2(L2:GND) A15.N1(N1:GND) A15.N2(N2:GND) A15.R1(R1:GND) A15.R2(R2:GND) A15.T1(T1:GND) A15.U2(U2:GND) A16.C2(GND) A17.A1(A1:GND) A17.C1(C1:GND) A17.C2(GND) A17.F1(F1:GND) A17.F2(F2:GND) A17.J2(J2:GND) A17.K1(K1:GND) A17.L2(L2:GND) A17.N1(N1:GND) A17.N2(N2:GND) A17.R1(R1:GND) A17.R2(R2:GND) A17.T1(T1:GND) A17.U2(U2:GND) A18.C2(GND) A19.C2(GND) A20.A1 A20.C1 A20.C2 A20.F1 A20.F2 A20.J2 A20.K1 A20.L2 A20.N1 A20.N2 A20.R1 A20.R2 A20.T1 A20.U2 A21.A1 A21.C1 A21.C2 A21.F1 A21.F2 A21.J2 A21.K1 A21.L2 A21.N1 A21.N2 A21.R1 A21.R2 A21.T1 A21.U2 A22.A1 A22.C1 A22.C2 A22.F1 A22.F2 A22.J2 A22.K1 A22.L2 A22.N1 A22.N2 A22.R1 A22.R2 A22.T1 A22.U2 A23.A1 A23.C1 A23.C2 A23.F1 A23.F2 A23.J2 A23.K1 A23.L2 A23.N1 A23.N2 A23.R1 A23.R2 A23.T1 A23.U2 A24.A1 A24.C1 A24.C2 A24.F1 A24.F2 A24.J2 A24.K1 A24.L2 A24.N1 A24.N2 A24.R1 A24.R2 A24.T1 A24.U2 B01.C2 B01.F2 B01.J2 B01.L2 B01.N2 B01.R2 B01.U2 B02.C2 B02.F2 B02.J2 B02.L2 B02.N2 B02.R2 B02.U2 B03.C2 B03.F2 B03.J2 B03.L2 B03.N2 B03.R2 B03.U2 B04.C2 B04.F2 B04.J2 B04.L2 B04.N2 B04.R2 B04.U2 B05.C2 B05.F2 B05.J2 B05.L2 B05.N2 B05.R2 B05.U2 B06.C2 B06.F2 B06.J2 B06.L2 B06.N2 B06.R2 B06.U2 B07.C2 B07.F2 B07.J2 B07.L2 B07.N2 B07.R2 B07.U2 B08.C2 B08.F2 B08.J2 B08.L2 B08.N2 B08.R2 B08.U2 B09.C2 B09.F2 B09.J2 B09.L2 B09.N2 B09.R2 B09.U2 B10.C2 B10.F2 B10.J2 B10.L2 B10.N2 B10.R2 B10.U2 B11.C2 B11.F2 B11.J2 B11.L2 B11.N2 B11.R2 B11.U2 B12.C2(GND) B13.C2(GND) B14.C2(GND) B15.A1(A1:GND) B15.C1(C1:GND) B15.C2(GND) B15.F1(F1:GND) B15.F2(F2:GND) B15.J2(J2:GND) B15.K1(K1:GND) B15.L2(L2:GND) B15.N1(N1:GND) B15.N2(N2:GND) B15.R1(R1:GND) B15.R2(R2:GND) B15.T1(T1:GND) B15.U2(U2:GND) B16.C2(GND) B16.T1(GND) B17.C2(GND) B17.T1(GND) B18.A1(A1:GND) B18.C1(C1:GND) B18.C2(GND) B18.F1(F1:GND) B18.F2(F2:GND) B18.J2(J2:GND) B18.K1(K1:GND) B18.L2(L2:GND) B18.N1(N1:GND) B18.N2(N2:GND) B18.R1(R1:GND) B18.R2(R2:GND) B18.T1(T1:GND) B18.U2(U2:GND) B19.C2(GND) B19.T1(GND) B20.C2(GND) B20.T1(GND) B21.A1(A1:GND) B21.C1(C1:GND) B21.C2(GND) B21.F1(F1:GND) B21.F2(F2:GND) B21.J2(J2:GND) B21.K1(K1:GND) B21.L2(L2:GND) B21.N1(N1:GND) B21.N2(N2:GND) B21.R1(R1:GND) B21.R2(R2:GND) B21.T1(T1:GND) B21.U2(U2:GND)
VCC: A12.A2(VCC) A13.A2(VCC) A14.A2(VCC) A15.A2(VCC) A16.A2(VCC) A17.A2(VCC) A18.A2(VCC) A19.A2(VCC) B12.A2(VCC) B13.A2(VCC) B14.A2(VCC) B15.A2(VCC) B16.A2(VCC) B17.A2(VCC) B18.A2(VCC) B19.A2(VCC) B20.A2(VCC) B21.A2(VCC)

## Library data of the parts
A01-A09 A10 A11 B01-B09 B10 B11 = dec-m:W011: One-sided 9 pin connector/cable with grounds (Negibus).
A12-A14 A16 B12-B14 = dec-m:M508: M508 Negative Bus Converter
A15 A17 B15 B18 B21 = dec-m:M906: Cable Terminator
A18 A19 = dec-m:M660: Positive Level Driver
A20-A24 = dec-m:M903: Two-sided Posibus cable/connector.
B16 B17 B19 B20 = dec-m:M051: M051 Positive Bus Converter
B22-B24 = dec-m:H807: Empty card slot

## Net classes
1 supply: width 1.27 mm